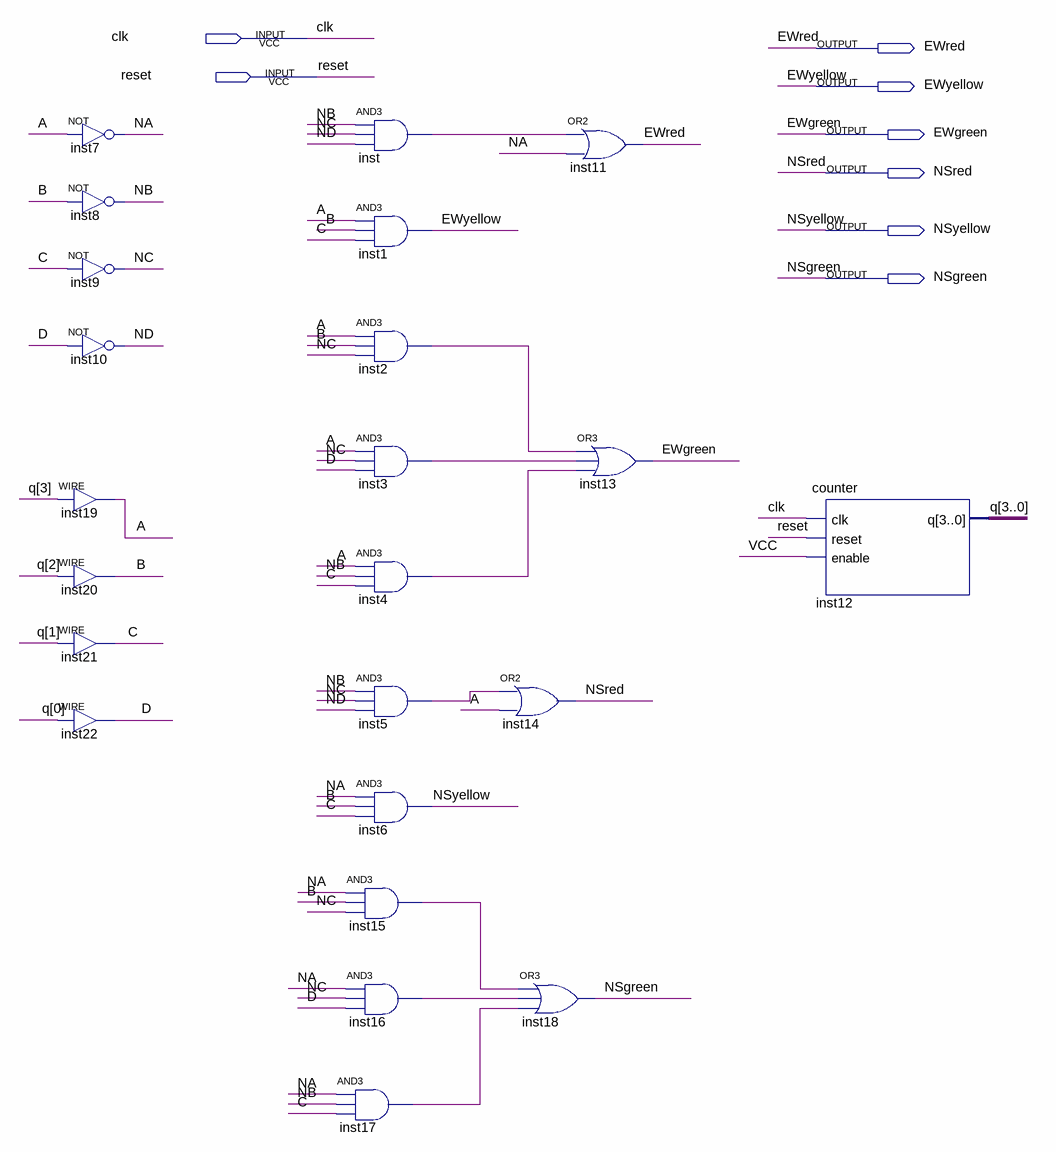
[diagram p0: schematic sheet]
// Quartus schematic traffic.bdf as structural Verilog: 23 symbols, 8 pins
module traffic (
  input  clk,
  input  reset,
  output EWred,
  output EWyellow,
  output EWgreen,
  output NSred,
  output NSyellow,
  output NSgreen
);

  wire A, B, C, D, inst2_out, inst3_out, inst4_out, inst5_out, inst15_out, inst16_out, inst17_out, inst_out,
       NA, NB, NC, ND, VCC;
  wire [3:0] q;

  not inst7 (NA, A);
  not inst8 (NB, B);
  not inst9 (NC, C);
  not inst10 (ND, D);
  assign A = q[3];  // WIRE inst19
  assign B = q[2];  // WIRE inst20
  assign C = q[1];  // WIRE inst21
  assign D = q[0];  // WIRE inst22
  and inst (inst_out, NB, NC, ND);
  and inst1 (EWyellow, A, B, C);
  and inst2 (inst2_out, A, B, NC);
  and inst3 (inst3_out, A, NC, D);
  and inst4 (inst4_out, A, NB, C);
  and inst5 (inst5_out, NB, NC, ND);
  and inst6 (NSyellow, NA, B, C);
  and inst15 (inst15_out, NA, B, NC);
  and inst16 (inst16_out, NA, NC, D);
  and inst17 (inst17_out, NA, NB, C);
  or inst14 (NSred, inst5_out, A);
  or inst18 (NSgreen, inst15_out, inst16_out, inst17_out);
  or inst11 (EWred, inst_out, NA);
  or inst13 (EWgreen, inst2_out, inst3_out, inst4_out);
  counter inst12 (.clk(clk), .reset(reset), .enable(VCC), .q(q));
endmodule
